# Altium project Led Strip 5050 3x parrallel 10mm.PrjPcb
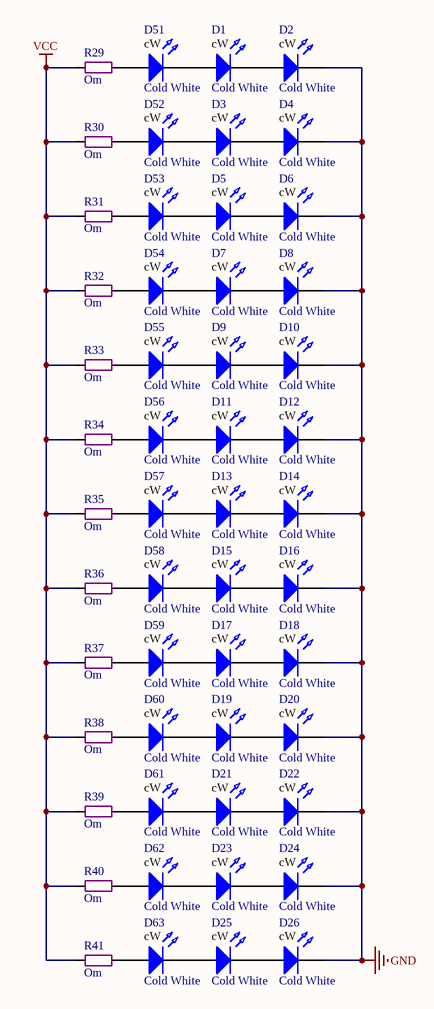
[diagram p0: Led Strip 5050 Parrallell.SchDoc]
1 sheet, 52 parts. Net scope: global (net labels, ports and power ports of the same name join across sheets).
Board file: Led Strip 5050 parrallel.PcbDoc

## Sheet Led Strip 5050 Parrallell.SchDoc
size A4

### Parts
D1  Cold White  [LED SMD 5050 White compact Parrl]
D2  Cold White  [LED SMD 5050 White compact Parrl]
D3  Cold White  [LED SMD 5050 White compact Parrl]
D4  Cold White  [LED SMD 5050 White compact Parrl]
D5  Cold White  [LED SMD 5050 White compact Parrl]
D6  Cold White  [LED SMD 5050 White compact Parrl]
D7  Cold White  [LED SMD 5050 White compact Parrl]
D8  Cold White  [LED SMD 5050 White compact Parrl]
D9  Cold White  [LED SMD 5050 White compact Parrl]
D10  Cold White  [LED SMD 5050 White compact Parrl]
D11  Cold White  [LED SMD 5050 White compact Parrl]
D12  Cold White  [LED SMD 5050 White compact Parrl]
D13  Cold White  [LED SMD 5050 White compact Parrl]
D14  Cold White  [LED SMD 5050 White compact Parrl]
D15  Cold White  [LED SMD 5050 White compact Parrl]
D16  Cold White  [LED SMD 5050 White compact Parrl]
D17  Cold White  [LED SMD 5050 White compact Parrl]
D18  Cold White  [LED SMD 5050 White compact Parrl]
D19  Cold White  [LED SMD 5050 White compact Parrl]
D20  Cold White  [LED SMD 5050 White compact Parrl]
D21  Cold White  [LED SMD 5050 White compact Parrl]
D22  Cold White  [LED SMD 5050 White compact Parrl]
D23  Cold White  [LED SMD 5050 White compact Parrl]
D24  Cold White  [LED SMD 5050 White compact Parrl]
D25  Cold White  [LED SMD 5050 White compact Parrl]
D26  Cold White  [LED SMD 5050 White compact Parrl]
D51  Cold White  [LED SMD 5050 White compact Parrl]
D52  Cold White  [LED SMD 5050 White compact Parrl]
D53  Cold White  [LED SMD 5050 White compact Parrl]
D54  Cold White  [LED SMD 5050 White compact Parrl]
D55  Cold White  [LED SMD 5050 White compact Parrl]
D56  Cold White  [LED SMD 5050 White compact Parrl]
D57  Cold White  [LED SMD 5050 White compact Parrl]
D58  Cold White  [LED SMD 5050 White compact Parrl]
D59  Cold White  [LED SMD 5050 White compact Parrl]
D60  Cold White  [LED SMD 5050 White compact Parrl]
D61  Cold White  [LED SMD 5050 White compact Parrl]
D62  Cold White  [LED SMD 5050 White compact Parrl]
D63  Cold White  [LED SMD 5050 White compact Parrl]
R29  Om  [SMD 1206 (3216)]
R30  Om  [SMD 1206 (3216)]
R31  Om  [SMD 1206 (3216)]
R32  Om  [SMD 1206 (3216)]
R33  Om  [SMD 1206 (3216)]
R34  Om  [SMD 1206 (3216)]
R35  Om  [SMD 1206 (3216)]
R36  Om  [SMD 1206 (3216)]
R37  Om  [SMD 1206 (3216)]
R38  Om  [SMD 1206 (3216)]
R39  Om  [SMD 1206 (3216)]
R40  Om  [SMD 1206 (3216)]
R41  Om  [SMD 1206 (3216)]

### Nets
GND: D2.K D4.K D6.K D8.K D10.K D12.K D14.K D16.K D18.K D20.K D22.K D24.K D26.K
VCC: R29.1 R30.1 R31.1 R32.1 R33.1 R34.1 R35.1 R36.1 R37.1 R38.1 R39.1 R40.1 R41.1
NetD1_A: D1.A D51.K
NetD1_K: D1.K D2.A
NetD3_A: D3.A D52.K
NetD3_K: D3.K D4.A
NetD5_A: D5.A D53.K
NetD5_K: D5.K D6.A
NetD7_A: D7.A D54.K
NetD7_K: D7.K D8.A
NetD9_A: D9.A D55.K
NetD9_K: D9.K D10.A
NetD11_A: D11.A D56.K
NetD11_K: D11.K D12.A
NetD13_A: D13.A D57.K
NetD13_K: D13.K D14.A
NetD15_A: D15.A D58.K
NetD15_K: D15.K D16.A
NetD17_A: D17.A D59.K
NetD17_K: D17.K D18.A
NetD19_A: D19.A D60.K
NetD19_K: D19.K D20.A
NetD21_A: D21.A D61.K
NetD21_K: D21.K D22.A
NetD23_A: D23.A D62.K
NetD23_K: D23.K D24.A
NetD25_A: D25.A D63.K
NetD25_K: D25.K D26.A
NetD51_A: D51.A R29.2
NetD52_A: D52.A R30.2
NetD53_A: D53.A R31.2
NetD54_A: D54.A R32.2
NetD55_A: D55.A R33.2
NetD56_A: D56.A R34.2
NetD57_A: D57.A R35.2
NetD58_A: D58.A R36.2
NetD59_A: D59.A R37.2
NetD60_A: D60.A R38.2
NetD61_A: D61.A R39.2
NetD62_A: D62.A R40.2
NetD63_A: D63.A R41.2

### Notes on the sheet
- (in symbol Led SMD White Cold) cW

### Library data of the parts
D1-D26 D51-D63 = Led SMD White Cold: ?3v ?20mA; Forward Voltage TYP: ?3; Resistor for 5v VCC: 240 Om; Forward Voltage Min: ?; Wave len min/typ: ?; Liminous Min (mcd): ?; Liminous Typ (mcd): ?; Forward Amp (mA): ?; Color: Cold White
R29-R41 = Res SMD 1206